# EAGLE schematic Schematic (EAGLE 9.6.2)
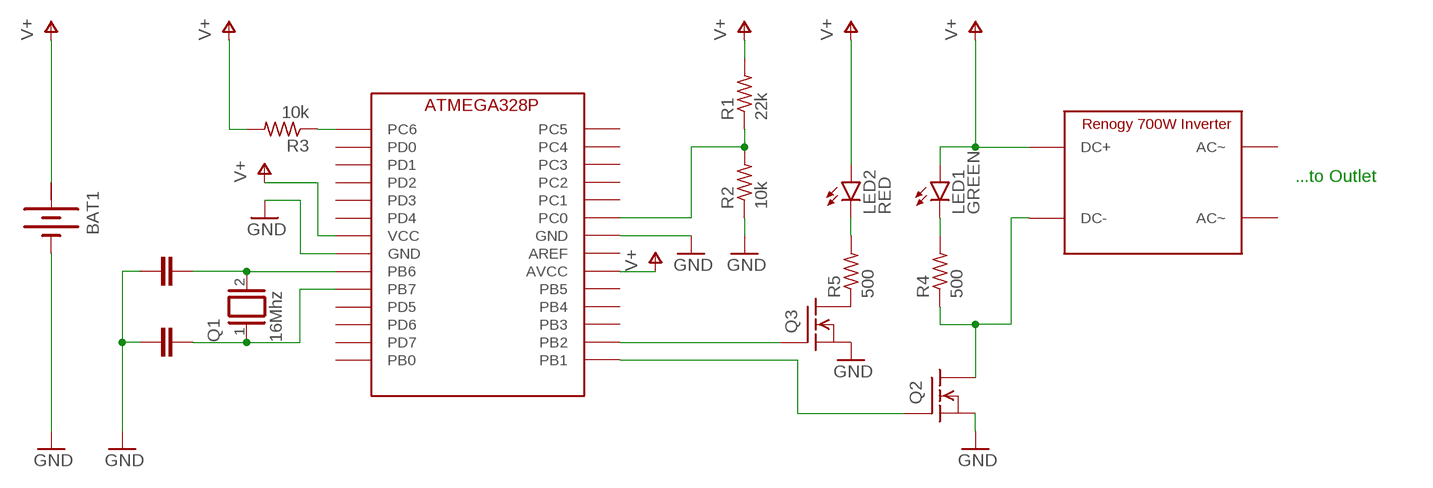
[diagram p0: schematic, sheet 1]

## Parts
BAT1  BATTERY  [BATTERY]
LED1  GREEN  LAP4-TOP  [P47F-TOP]
LED2  RED  LAP4-TOP  [P47F-TOP]
Q1  16Mhz  XTAL  [Q]
Q2  IRF540  [TO220]
Q3  IRF540  [TO220]
R1  22k  R-US_R0402  [R0402]
R2  10k  R-US_R0402  [R0402]
R3  10k  R-US_R0402  [R0402]
R4  500  R-US_R0402  [R0402]
R5  500  R-US_R0402  [R0402]
U$1  ATMEGA328P  (no package)
U$2  INVERTER  (no package)

## Nets
GND: BAT1.- Q2.3(S) Q3.3(S) R2.1 U$1.GND
N$1: R1.1 R2.2 U$1.PC0
N$2: Q1.2 U$1.PB6
N$3: Q1.1 U$1.PB7
N$4: R3.1 U$1.PC6
N$5: Q2.2(D) R4.1 U$2.DC-
N$6: LED1.C R4.2
N$7: LED2.C R5.2
N$8: Q2.1(G) U$1.PB1
N$9: Q3.2(D) R5.1
N$10: Q3.1(G) U$1.PB2
V+: BAT1.+ LED1.A LED2.A R1.2 R3.2 U$1.AVCC U$1.VCC U$2.DC+
Unconnected: U$1.AREF U$1.PB0 U$1.PB3 U$1.PB4 U$1.PB5 U$1.PC1 U$1.PC2 U$1.PC3 U$1.PC4 U$1.PC5 U$1.PD0 U$1.PD1 U$1.PD2 U$1.PD3 U$1.PD4 U$1.PD5 U$1.PD6 U$1.PD7 U$2.AC~

## Notes on the sheet
- ...to Outlet

## Power pins joined to a net without a drawn wire
+: BAT1.+@1(+)

## Library data of the parts
BAT1 = special:BATTERY: BATTERY
LED1 LED2 = led:*P4: PointLED® Enhanced Thinfilm LED TOP & BOTTOM mount LS P47F, LR P47F, LA P47F, LY P47F, LT P4SG, LB P4SG, LW P4SG Source: http://catalog.osram-os.com .. LA_LR_LS_LY_P47F_Pb_free.pdf
Q1 = special:XTAL: CRYSTAL
Q2 Q3 = transistor-fet:IRF540: N-Channel Enhancement MOSFET (HEXFET); 100V; 28A; 0,077Ohm
R1-R5 = rcl:R-US_: RESISTOR, American symbol; SPICEPREFIX: R
U$1 = Ferry:ATMEGA328P
U$2 = Ferry:INVERTER